# EAGLE design Nikon 10pin breakout (EAGLE 8.5.0)
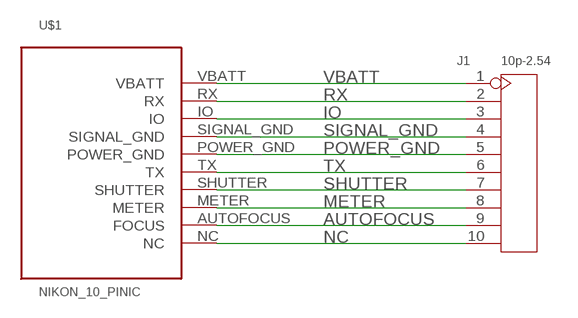
[diagram p0: schematic, sheet 1]

## Parts
J1  10p-2.54  DIP-LONG-BLUE-FEMALE-HEADER(10P-2.54)  [H10-2.54]
U$1  NIKON_10_PINIC  [TH]

## Nets
AUTOFOCUS: J1.9 U$1.AUTOFOCUS(FOCUS)
IO: J1.3 U$1.IO
METER: J1.8 U$1.METER
NC: J1.10 U$1.NC
POWER_GND: J1.5 U$1.POWER_GND
RX: J1.2 U$1.RX
SHUTTER: J1.7 U$1.SHUTTER
SIGNAL_GND: J1.4 U$1.SIGNAL_GND
TX: J1.6 U$1.TX
VBATT: J1.1 U$1.VBATT

## Library data of the parts
J1 = Seeed-Connector:DIP-LONG-BLUE-FEMALE-HEADER(10P-2.54): 320030001
U$1 = Nikon 10 pin breakout:NIKON_10_PIN

## Board
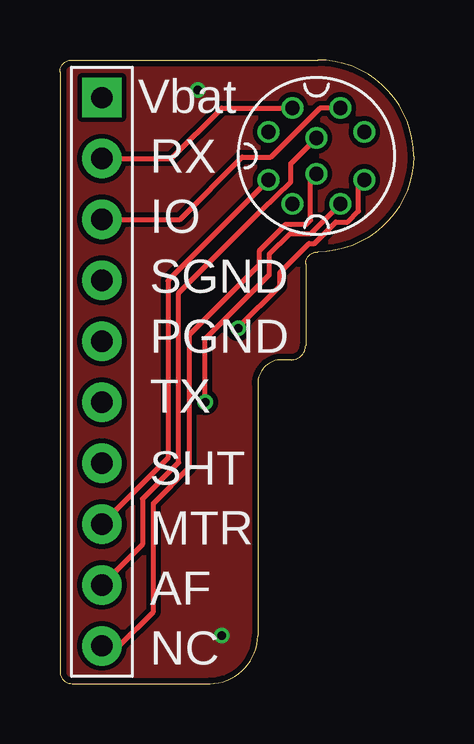
[diagram p1: board, top side]
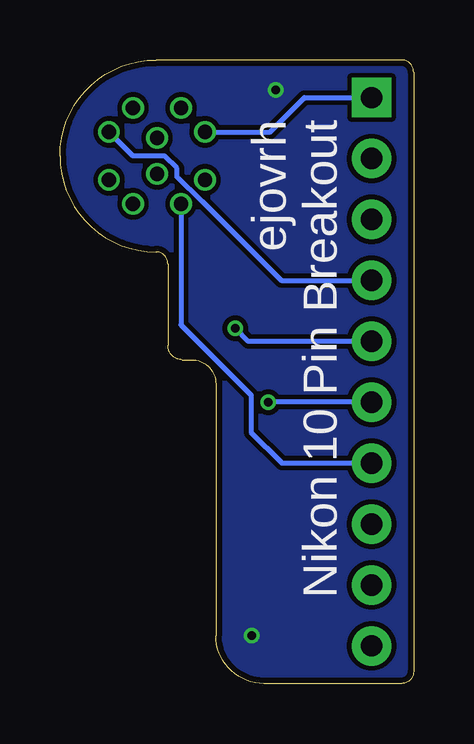
[diagram p2: board, bottom side, seen from below]

Size 14.75 x 26 mm. Coordinates in mm from the lower left corner, seen from the top.
Outline: 0.5,26 10.75,26 arc-90 14.75,22 arc-90 10.75,18 arc90 10.25,17.5 10.25,14.1 arc-90 9.65,13.5 9.25,13.5 arc90 8.25,12.5 8.25,2 arc-90 6.25,0 0.5,0 arc-90 0,0.5 0,25.5 arc-90 0.5,26
Copper layers (1*16): Top 0.035mm / dielectric 1.5mm / Bottom 0.035mm
Design rules "markovac_2layer *": minimum track width 0.2mm, minimum drill 0.3mm, track to track 0.2mm, track to pad 0.2mm, pad to pad 0.2mm, via to via 0.2mm, smd to smd 0.2mm, copper to edge 0.25mm, drill to drill 8mil, minimum pad ring 0.15mm, minimum via ring 0.15mm, stop-mask expansion 4mil, vias tented up to drill 25mil, thermal gap 10mil

### Footprints (pad centres in the part's own frame; a part is rotated, then mirrored left to right if it is on the bottom)
H10-2.54 = drill 0.889 pad 1.651 square: 1 0,11.43 | drill 0.889 pad 1.651: 2 0,8.89; 3 0,6.35; 4 0,3.81; 5 0,1.27; 6 0,-1.27; 7 0,-3.81; 8 0,-6.35; 9 0,-8.89; 10 0,-11.43
TH = drill 0.6: AUTOFOCUS 0,0.75; IO 1,2; METER -2,-1; NC 0,-0.75; POWER_GND 2,-1; RX -1,2; SHUTTER -1,-2; SIGNAL_GND 2,1; TX 1,-2; VBATT -2,1

### Placement (x,y rotation side)
J1  1.75,13 0 top
U$1  10.7,22 0 top

### Tracks (layer width: path | path; a pad name or v marks a point on that pad's centre or on a via)
AUTOFOCUS
  Top 0.2: J1.9 3.45,5.8 3.45,7.7 4.95,9.21 4.95,16.28 8.41,19.74 9.63,20.92 9.63,21.68 U$1.AUTOFOCUS
GND  (via drill 0.35)
  other vias: 6.75,2 5.75,24.75
  pour Bottom: 0.75,-0.5 5.25,-0.5 arc90 8.25,2.5 8.25,12 arc-90 9.25,13 9.75,13 arc90 10.75,14 10.75,17.5 arc90 15.25,22 arc90 10.75,26.5 0.75,26.5 arc90 -0.25,25.5 -0.25,0.5 arc90
  pour Top: 0.75,-0.5 5.25,-0.5 arc90 8.25,2.5 8.25,12 arc-90 9.25,13 9.75,13 arc90 10.75,14 10.75,17.5 arc90 15.25,22 arc90 10.75,26.5 0.75,26.5 arc90 -0.25,25.5 -0.25,0.5 arc90
IO
  Top 0.2: J1.3 5,19.35 7.6,21.95 8.8,21.95 10.85,24 U$1.IO
METER
  Top 0.2: J1.8 4.5,9.4 4.5,16.8 U$1.METER
NC
  Top 0.2: J1.10 2.47,1.57 3.9,3 3.9,7.52 5.41,9.02 5.41,14.55 8.32,17.47 8.32,18.05 9.42,19.15 10.28,19.15 10.45,19.32 10.45,21 U$1.NC
POWER_GND  (via drill 0.35)
  Top 0.2: 7.44,14.85 9.17,16.58 9.17,17.12 10.39,18.35 10.62,18.35 11.51,19.25 12,19.25 12.45,19.69 12.45,20.75 U$1.POWER_GND
  Top 0.254: 7.44,14.85 v7.44,14.81
  Bottom 0.2: v7.44,14.81 6.89,14.27 J1.5
RX
  Top 0.2: J1.2 4.64,21.89 6.75,24 U$1.RX
SHUTTER
  Bottom 0.2: J1.7 5.5,9.19 6.78,10.47 6.78,12.03 9.7,14.95 U$1.SHUTTER
SIGNAL_GND
  Bottom 0.2: U$1.SIGNAL_GND 11.7,22 10.39,22 9.87,21.48 9.87,21.13 8.83,20.12 5.51,16.81 J1.4
TX  (via drill 0.35)
  Top 0.2: v6.06,11.73 6.06,14.36 8.72,17.02 8.72,17.89 9.59,18.75 10.45,18.75 U$1.TX
  Bottom 0.2: J1.6 v6.06,11.73
VBATT
  Bottom 0.2: J1.1 4.56,24.43 5.99,23 U$1.VBATT

### Text on the board
tPlace: Vbat | RX | IO | SGND | PGND | TX | SHT | MTR | AF | NC
bPlace: ejovrh / Nikon 10 Pin Breakout